# Altium schematic sheet PWR_IN.SchDoc: POWER
size A4; DrawnBy: ThanhQuoc; Organization: ORGANIZATION; Address1: ADDRESS 1; Address2: ADDRESS 2; Address3: ADDRESS 3; Address4: ADDRESS 4; Revision: V01; SheetNumber: 3; SheetTotal: 21; Project: RV1126 CAMERA BOARD DESIGN; ENG_APP_DATE: --/--/--; DSN_APP_DATE: --/--/--; ImagePath: "C:\Users\Admin\Downloads\Gemini_Generated_Image_ajh2r8ajh2r8ajh2.png"
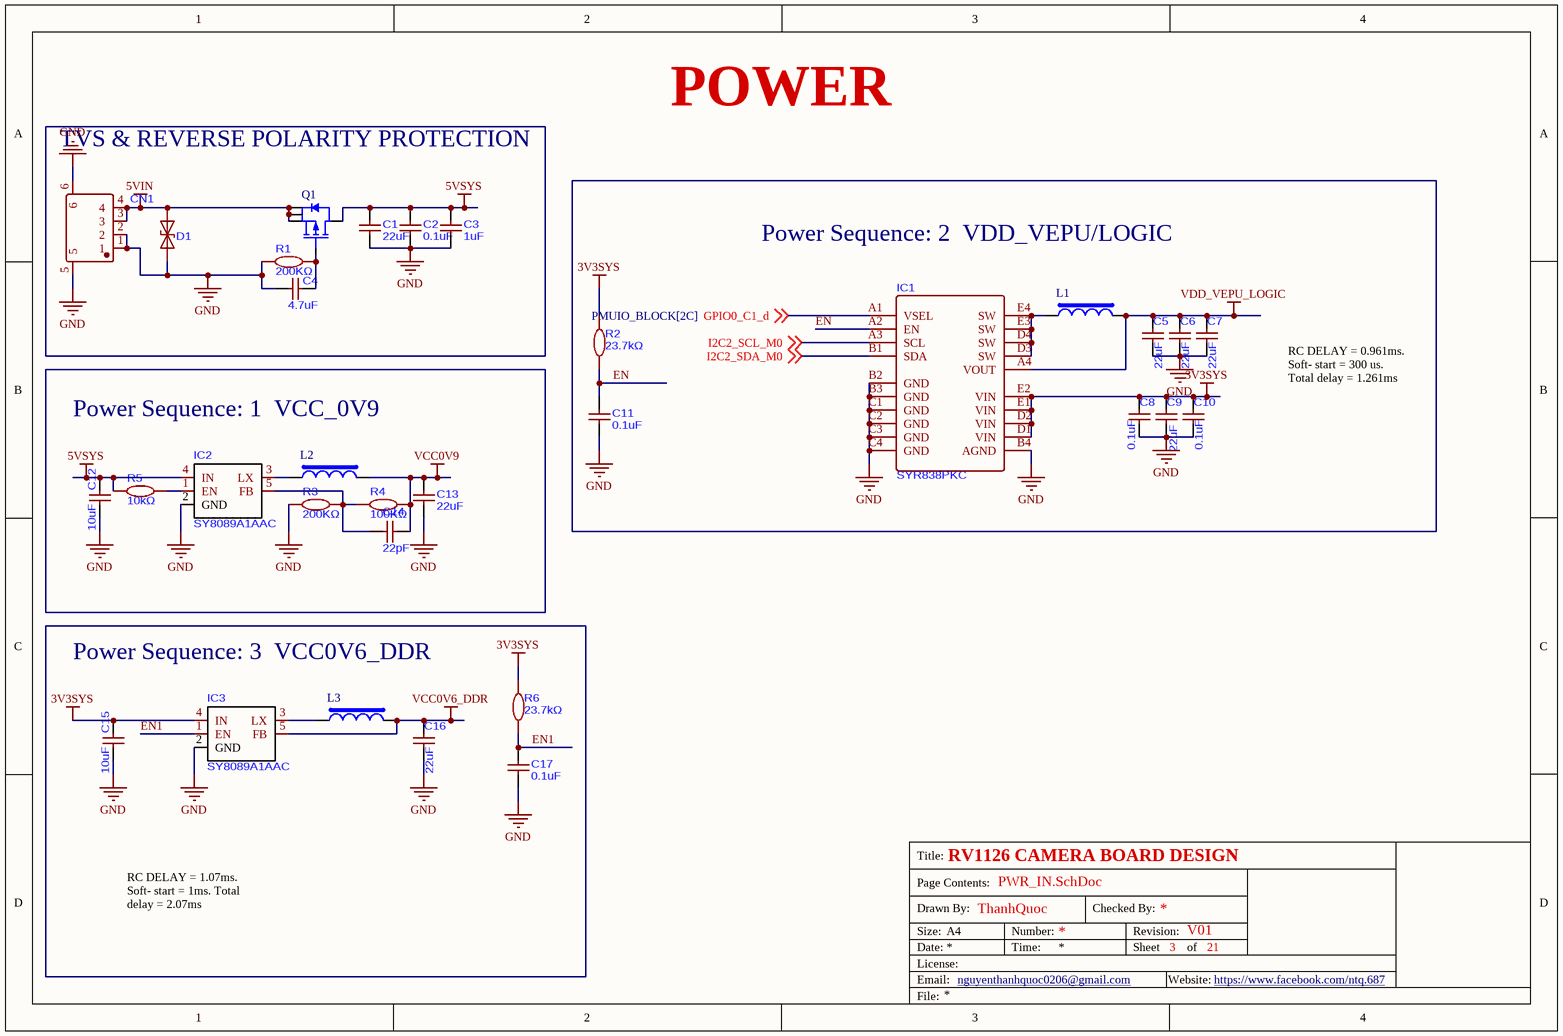
[diagram p0: PWR_IN.SchDoc]

## Parts
C1  22uF  [C0603]
C2  0.1uF  [C0201]
C3  1uF  [C0201]
C4  4.7uF  [C0402]
C5  22uF  [C0402]
C6  22uF  [C0402]
C7  22uF  [C0402]
C8  0.1uF  [C0201]
C9  22uF  [C0603]
C10  0.1uF  [C0201]
C11  0.1uF  [C0201]
C12  10uF  [C0402]
C13  22uF  [C0402]
C14  22pF  [C0201]
C15  10uF  [C0402]
C16  22uF  [C0402]
C17  0.1uF  [C0201]
CN1  SMD,P=2mm,Surface Mount,Right Angle  [CONN-SMD_4P-P2.00_WTBA0-BH004]  (value not drawn)
D1  TVS DIODE 5VWM 10VC X1-SON-2(0.6x1)  [X1SON-2_L1.0-W0.6-P0.65-BI-1]  (value not drawn)
IC1  SYR838PKC  [BGA-20_L15.6-W2.0-R4-C6-P0.40-BL]
IC2  SY8089A1AAC  [SOT-23-5_L3.0-W1.7-P0.95-LS2.8-BR]
IC3  SY8089A1AAC  [SOT-23-5_L3.0-W1.7-P0.95-LS2.8-BR]
L1  FTC252012SR47MBCA  [IND_1008]  (value not drawn)
L2  APH252012C1R0MP01  [IND_1008]  (value not drawn)
L3  APH252012C1R0MP01  [IND_1008]  (value not drawn)
Q1  SI7615CDN-T1-GE3  [PowerPAK_1212-8_SMD]  (value not drawn)
R1  200KΩ  [R0201]
R2  23.7kΩ  [R0402]
R3  200KΩ  [R0201]
R4  100KΩ  [R0201]
R5  10kΩ  [R0201]
R6  23.7kΩ  [R0402]

## Nets
3V3SYS: C8.2 C9.2 C10.2 C15.2 IC1.D1(VIN) IC1.D2(VIN) IC1.E1(VIN) IC1.E2(VIN) IC3.4(IN) R2.2 R6.2
5VIN: CN1.3 CN1.4 D1.2(A) Q1.1(S) Q1.2(S) Q1.3(S)
5VSYS: C1.2 C2.2 C3.2 C12.2 IC2.4(IN) Q1.5(D) R5.1
GND: C1.1 C2.1 C3.1 C4.2 C5.1 C6.1 C7.1 C8.1 C9.1 C10.1 C11.1 C12.1 C13.1 C15.1 C16.1 C17.1 CN1.1 CN1.2 CN1.5 CN1.6 D1.1(K) IC1.B2(GND) IC1.B3(GND) IC1.B4(AGND) IC1.C1(GND) IC1.C2(GND) IC1.C3(GND) IC1.C4(GND) IC2.2(GND) IC3.2(GND) R1.1 R3.1
VCC0V6_DDR: C16.2 IC3.5(FB) L3.2
VCC0V9: C13.2 C14.2 L2.2 R4.2
VDD_VEPU_LOGIC: C5.2 C6.2 C7.2 IC1.A4(VOUT) L1.2
EN: C11.2 IC1.A2(EN) R2.1
EN1: C17.2 IC3.1(EN) R6.1
GPIO0_C1_d: IC1.A1(VSEL) ; off-sheet GPIO0_C1_d
I2C2_SCL_M0: IC1.A3(SCL) ; off-sheet I2C2_SCL_M0
I2C2_SDA_M0: IC1.B1(SDA) ; off-sheet I2C2_SDA_M0
NetC4_1: C4.1 Q1.4(G) R1.2
NetC14_1: C14.1 IC2.5(FB) R3.2 R4.1
NetIC1_D3: IC1.D3(SW) IC1.D4(SW) IC1.E3(SW) IC1.E4(SW) L1.1
NetIC2_1: IC2.1(EN) R5.2
NetIC2_3: IC2.3(LX) L2.1
NetIC3_3: IC3.3(LX) L3.1

## Notes on the sheet
- TVS & REVERSE POLARITY PROTECTION
- Power Sequence: 2  VDD_VEPU/LOGIC
- Power Sequence: 1  VCC_0V9
- RC DELAY = 0.961ms. Soft- start = 300 us. Total delay = 1.261ms
- Power Sequence: 3  VCC0V6_DDR
- RC DELAY = 1.07ms. Soft- start = 1ms. Total delay = 2.07ms
- Title:
- Drawn By:
- Page Contents:
- Checked By:
- Size:
- Date:
- File:
- License:
- Email:
- A4
- nguyenthanhquoc0206@gmail.com
- Number:
- Time:
- Revision:
- Sheet
- Website:
- of
- https://www.facebook.com/ntq.687

## Library data of the parts
C1 = CAP_22uF-25V-20%-0603: 22uF ±20% 25V Ceramic Capacitor X5R 0603
C2 C8 C10 C11 C17 = CAP_100nF-16V-10%-0201: CAP CER 100nF 16V X5R 0201
C3 = CAP_1uF-10V-10%-0201: 1uF ±10% 10V Ceramic Capacitor X5R 0201
C4 = CAP_4.7uF-16V-10%-0402: 4.7uF ±10% 16V Ceramic Capacitor X5R 0402
C5-C7 C13 C16 = CAP_22uF-10V-20%-0402: 22uF X5R ±20% 10V 0402 Ceramic Capacitors RoHS; ComponentLink1Description: LCSC; ComponentLink1URL: https://www.lcsc.com/product-detail/C385994.html?s_z=n_q_t_22UF&spm=wm.fly.bg.2.xh___wm.ssy.tc.2.tz&lcsc_vid=EwRWBFZSQVIPVFdUTlJfVldeFFRYUFQAElRYBFRRE1MxVlNeRFZbX1BRRVlbVDsOAxUeFF5JWBYZEEoKFBINSQcJGk4NBhADEA4cHktXRlhXSQwSGg0%3D
C9 = CAP_22uF-16V-20%-0603: 22uF ±20% 16V Ceramic Capacitor X5R 0603
C12 C15 = CAP_10uF-10V-20%-0402: 10µF ±20% 10V Ceramic Capacitor X5R 0402 (1005 Metric)
C14 = CAP_22pF-50V-5%-0201: CAP CER 22pF 50V NP0 0201
CN1 = 5023520401: DuraClik(MX 2.0) 125V 4 1 2mm 3A Surface Mount, Right Angle Tin -40℃~+105℃ 4P Black 1x4P SMD,P=2mm,Surface Mount,Right Angle Headers, Male Pins RoHS
D1 = LTVS8H5.0CAT5G
IC1 = SYR838PKC: High-efficiency 5.5V, 6A, 2.4MHz synchronous buck regulator
IC2 IC3 = SY8089A1AAC: High Efficiency, 1.5MHz, 2A Synchronous Step Down Regulator; ComponentLink1Description: LCSC; ComponentLink1URL: https://www.lcsc.com/product-detail/C479074.html?s_z=n_q_SY8089A&spm=wm.fly.bg.0.xh&lcsc_vid=EwRWBFZSQVIPVFdUTlJfVldeFFRYUFQAElRYBFRRE1MxVlNeRVlcV1JUT1FeXzsOAxUeFF5JWBYZEEoKFBINSQcJGk4NBhADEA4cHktXR1NXSQwSGg0%3D
L1 = IND_470nH-6.5A-20%-1008: FIXED IND 0.47uH 6.5A 13mΩ SMD,2x2.5mm; Manufacturer: Murata Electronics; Manufacturer Part Number: DFE252010P-R47M=P2; Case/Package: 1008; Supplier-1: Digikey
L2 L3 = IND_1uH-4A-20%-1008: FIXED IND 01uH 4A 35mΩ SMD,2x2.5mm; Manufacturer: Murata Electronics; Manufacturer Part Number: DFE252010P-R47M=P2; Case/Package: 1008; Supplier-1: Digikey
Q1 = SI7615CDN-T1-GE3-MS: 22W 20V 60A 700mV 7mΩ@4.5V 1 P-Channel P-Channel DFN-8L(3x3) Single FETs, MOSFETs RoHS; Manufacturer: Vishay Siliconix; Manufacturer Part Number: SI7615CDN-T1-GE3; Case/Package: PowerPAK® 1212-8; Supplier-1: Digikey
R1 R3 = RES_200K-50mW-1%-0201: RES 200kΩ ±1% 50mW 0201
R2 R6 = RES_23.7K-0.063W-0.1%-0402: RES 23700Ω ±0.1% 0.063W 0402; ComponentLink1Description: LCSC; ComponentLink1URL: https://www.lcsc.com/product-detail/C2076022.html?s_z=n_q_t_23.7K&spm=wm.fly.bg.0.xh___wm.ssy.tc.0.tz&lcsc_vid=EwRWBFZSQVIPVFdUTlJfVldeFFRYUFQAElRYBFRRE1MxVlNeRFdWV1xeQVRYUzsOAxUeFF5JWBYZEEoKFBINSQcJGk4NBhADEA4cHktXR1NXSQwSGg0%3D
R4 = RES_100K-50mW-1%-0201: RES 100kΩ ±1% 50mW 0201; ComponentLink1Description: LCSC; ComponentLink1URL: https://www.lcsc.com/product-detail/C295718.html?s_z=n_q_t_120%2520OHM&spm=wm.fly.bg.5.xh___wm.ssy.tc.1.tz&lcsc_vid=EwRWBFZSQVIPVFdUTlJfVldeFFRYUFQAElRYBFRRE1MxVlNeRFZeU1BfTlBYVzsOAxUeFF5JWBYZEEoKFBINSQcJGk4eFQsCAgIaSgADAwAHC0slRVhcV1ZTT08GEwkK
R5 = RES_10K-50mW-1%-0201: RES 10KΩ ±1% 50mW 0201; ComponentLink1Description: LCSC; ComponentLink1URL: https://www.lcsc.com/product-detail/C93949.html?spm=wm.fly.bg.0.xh&lcsc_vid=EwRWBFZSQVIPVFdUTlJfVldeFFRYUFQAElRYBFRRE1MxVlNeRVlXUFNQQ1RWXjsOAxUeFF5JWBYZEEoKFBINSQcJGk4eFQsCAgIaSgADAwAHC0slRlVYUFFIHxUDCw%3D%3D